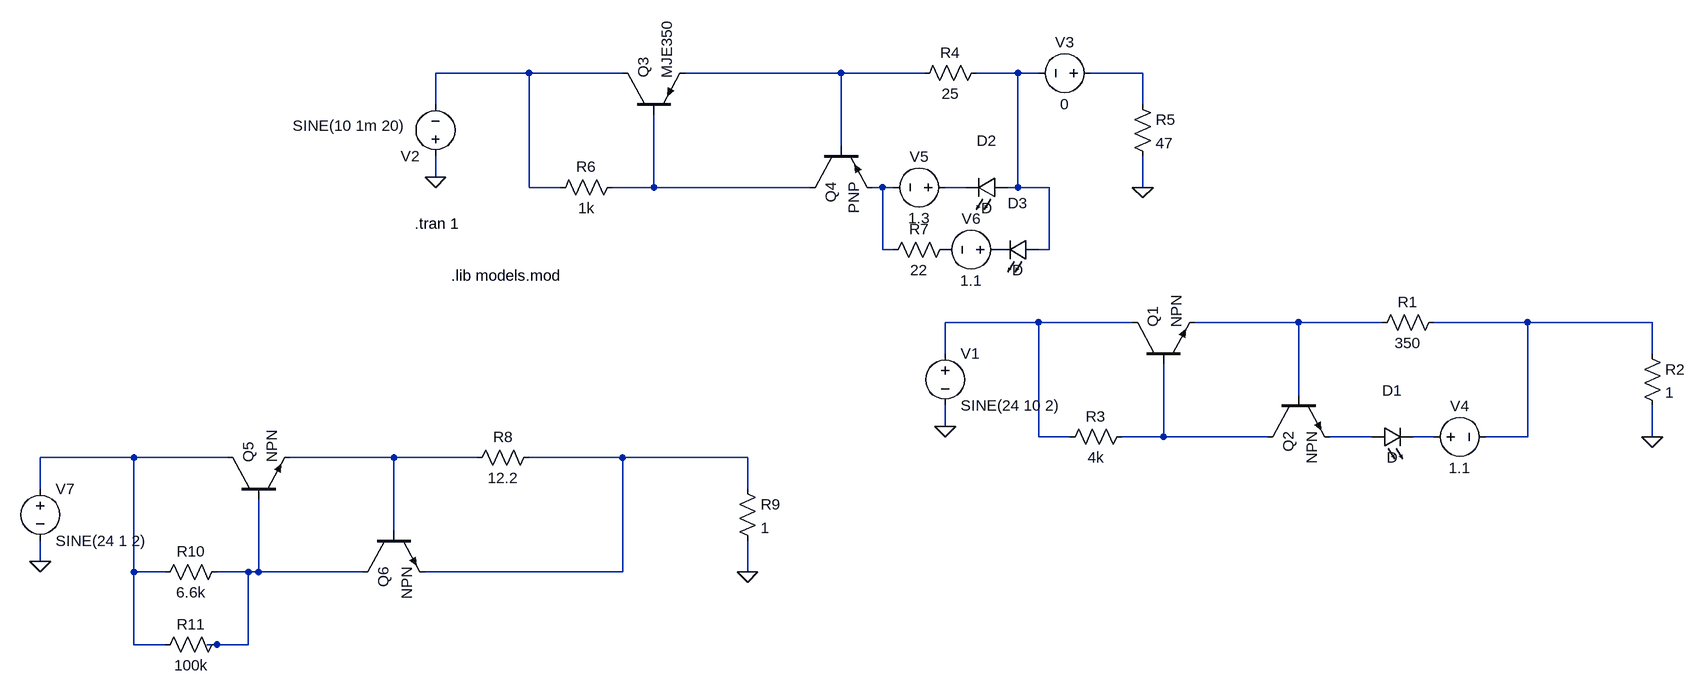
[diagram p0: schematic prot.asc]
prot.asc, the LTspice schematic file:
Version 4
SHEET 1 1220 760
WIRE -1040 -192 -1184 -192
WIRE -896 -192 -1040 -192
WIRE -560 -192 -800 -192
WIRE -432 -192 -560 -192
WIRE -288 -192 -352 -192
WIRE -256 -192 -288 -192
WIRE -96 -192 -176 -192
WIRE -1184 -144 -1184 -192
WIRE -96 -144 -96 -192
WIRE -560 -80 -560 -192
WIRE -1184 -32 -1184 -64
WIRE -1040 -16 -1040 -192
WIRE -992 -16 -1040 -16
WIRE -848 -16 -848 -128
WIRE -848 -16 -912 -16
WIRE -608 -16 -848 -16
WIRE -496 -16 -512 -16
WIRE -480 -16 -496 -16
WIRE -368 -16 -400 -16
WIRE -288 -16 -288 -192
WIRE -288 -16 -304 -16
WIRE -240 -16 -288 -16
WIRE -96 -16 -96 -64
WIRE -496 80 -496 -16
WIRE -480 80 -496 80
WIRE -240 80 -240 -16
WIRE -240 80 -256 80
WIRE -256 192 -400 192
WIRE -112 192 -256 192
WIRE 144 192 -16 192
WIRE 272 192 144 192
WIRE 496 192 352 192
WIRE 688 192 496 192
WIRE -400 240 -400 192
WIRE 688 240 688 192
WIRE 144 304 144 192
WIRE -400 352 -400 320
WIRE -256 368 -256 192
WIRE -208 368 -256 368
WIRE -64 368 -64 256
WIRE -64 368 -128 368
WIRE 96 368 -64 368
WIRE 256 368 192 368
WIRE 352 368 320 368
WIRE 496 368 496 192
WIRE 496 368 432 368
WIRE 688 368 688 320
WIRE -1648 400 -1792 400
WIRE -1504 400 -1648 400
WIRE -1248 400 -1408 400
WIRE -1120 400 -1248 400
WIRE -896 400 -1040 400
WIRE -704 400 -896 400
WIRE -1792 448 -1792 400
WIRE -704 448 -704 400
WIRE -1248 512 -1248 400
WIRE -1792 560 -1792 528
WIRE -1648 576 -1648 400
WIRE -1600 576 -1648 576
WIRE -1472 576 -1520 576
WIRE -1456 576 -1456 464
WIRE -1456 576 -1472 576
WIRE -1296 576 -1456 576
WIRE -896 576 -896 400
WIRE -896 576 -1200 576
WIRE -704 576 -704 528
WIRE -1648 688 -1648 576
WIRE -1600 688 -1648 688
WIRE -1520 688 -1536 688
WIRE -1472 688 -1472 576
WIRE -1472 688 -1520 688
FLAG 688 368 0
FLAG -400 352 0
FLAG -96 -16 0
FLAG -1184 -32 0
FLAG -704 576 0
FLAG -1792 560 0
SYMBOL npn -112 256 R270
SYMATTR InstName Q1
SYMBOL npn 96 304 M90
SYMATTR InstName Q2
SYMBOL res 368 176 R90
WINDOW 0 0 56 VBottom 2
WINDOW 3 32 56 VTop 2
SYMATTR InstName R1
SYMATTR Value 350
SYMBOL res 672 224 R0
SYMATTR InstName R2
SYMATTR Value 1
SYMBOL res -112 352 R90
WINDOW 0 0 56 VBottom 2
WINDOW 3 32 56 VTop 2
SYMATTR InstName R3
SYMATTR Value 4k
SYMBOL voltage -400 224 R0
WINDOW 123 0 0 Left 2
WINDOW 39 0 0 Left 2
SYMATTR InstName V1
SYMATTR Value SINE(24 10 2)
SYMBOL res -336 -208 R90
WINDOW 0 0 56 VBottom 2
WINDOW 3 32 56 VTop 2
SYMATTR InstName R4
SYMATTR Value 25
SYMBOL res -112 -160 R0
SYMATTR InstName R5
SYMATTR Value 47
SYMBOL res -896 -32 R90
WINDOW 0 0 56 VBottom 2
WINDOW 3 32 56 VTop 2
SYMATTR InstName R6
SYMATTR Value 1k
SYMBOL voltage -1184 -48 R180
WINDOW 123 0 0 Left 2
WINDOW 39 0 0 Left 2
WINDOW 3 46 63 Left 2
SYMATTR Value SINE(10 1m 20)
SYMATTR InstName V2
SYMBOL pnp -608 -80 M90
SYMATTR InstName Q4
SYMBOL pnp -896 -128 R270
SYMATTR InstName Q3
SYMATTR Value MJE350
SYMBOL voltage -160 -192 R90
WINDOW 0 -32 56 VBottom 2
WINDOW 3 32 56 VTop 2
WINDOW 123 0 0 Left 2
WINDOW 39 0 0 Left 2
SYMATTR InstName V3
SYMATTR Value 0
SYMBOL LED 256 384 R270
WINDOW 0 72 32 VTop 2
WINDOW 3 0 32 VBottom 2
SYMATTR InstName D1
SYMBOL voltage 336 368 R270
WINDOW 0 32 56 VTop 2
WINDOW 3 -32 56 VBottom 2
WINDOW 123 0 0 Left 2
WINDOW 39 0 0 Left 2
SYMATTR InstName V4
SYMATTR Value 1.1
SYMBOL LED -304 0 M270
WINDOW 0 72 32 VTop 2
WINDOW 3 0 32 VBottom 2
SYMATTR InstName D2
SYMBOL voltage -384 -16 M270
WINDOW 0 32 56 VTop 2
WINDOW 3 -32 56 VBottom 2
WINDOW 123 0 0 Left 2
WINDOW 39 0 0 Left 2
SYMATTR InstName V5
SYMATTR Value 1.3
SYMBOL res -384 64 R90
WINDOW 0 0 56 VBottom 2
WINDOW 3 32 56 VTop 2
SYMATTR InstName R7
SYMATTR Value 22
SYMBOL LED -256 96 M270
WINDOW 0 72 32 VTop 2
WINDOW 3 0 32 VBottom 2
SYMATTR InstName D3
SYMBOL voltage -304 80 M270
WINDOW 0 32 56 VTop 2
WINDOW 3 -32 56 VBottom 2
WINDOW 123 0 0 Left 2
WINDOW 39 0 0 Left 2
SYMATTR InstName V6
SYMATTR Value 1.1
SYMBOL npn -1504 464 R270
SYMATTR InstName Q5
SYMBOL npn -1296 512 M90
SYMATTR InstName Q6
SYMBOL res -1024 384 R90
WINDOW 0 0 56 VBottom 2
WINDOW 3 32 56 VTop 2
SYMATTR InstName R8
SYMATTR Value 12.2
SYMBOL res -720 432 R0
SYMATTR InstName R9
SYMATTR Value 1
SYMBOL res -1504 560 R90
WINDOW 0 0 56 VBottom 2
WINDOW 3 32 56 VTop 2
SYMATTR InstName R10
SYMATTR Value 6.6k
SYMBOL voltage -1792 432 R0
WINDOW 123 0 0 Left 2
WINDOW 39 0 0 Left 2
SYMATTR InstName V7
SYMATTR Value SINE(24 1 2)
SYMBOL res -1504 672 R90
WINDOW 0 0 56 VBottom 2
WINDOW 3 32 56 VTop 2
SYMATTR InstName R11
SYMATTR Value 100k
TEXT -1216 40 Left 2 !.tran 1
TEXT -1160 120 Left 2 !.lib models.mod

The netlist it stands for:
* prot.asc
Q1 N008 N011 N009 0 NPN
Q2 N011 N009 N012 0 NPN
R1 N010 N009 350
R2 N010 0 1
R3 N011 N008 4k
V1 N008 0 SINE(24 10 2)
R4 N003 N002 25
R5 N004 0 47
R6 N005 N001 1k
V2 0 N001 SINE(10 1m 20)
Q4 N005 N002 N006 0 PNP
Q3 N001 N005 N002 0 MJE350
V3 N004 N003 0
D1 N012 N013 D
V4 N013 N010 1.1
D2 N003 N007 D
V5 N007 N006 1.3
R7 P001 N006 22
D3 N003 P002 D
V6 P002 P001 1.1
Q5 N014 N017 N015 0 NPN
Q6 N017 N015 N016 0 NPN
R8 N016 N015 12.2
R9 N016 0 1
R10 N017 N014 6.6k
V7 N014 0 SINE(24 1 2)
R11 N017 N014 100k
.model D D
.lib standard.dio
.model NPN NPN
.model PNP PNP
.lib standard.bjt
.tran 1
.lib models.mod
.backanno
.end